# Altium project Rover Power Board V1.PrjPcb
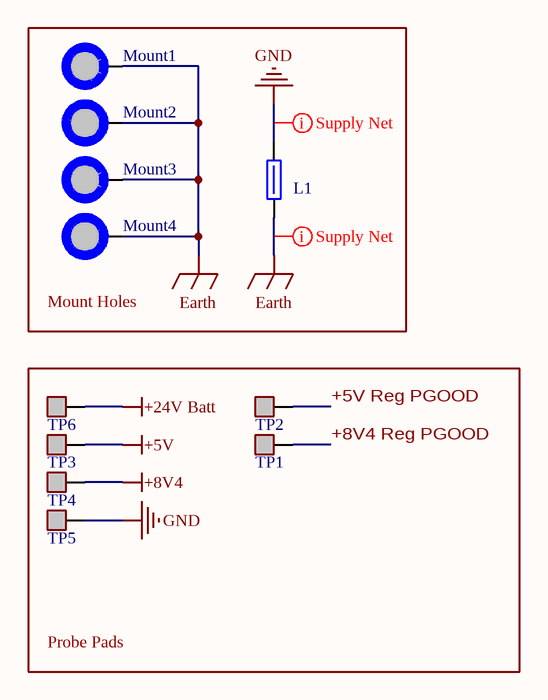
[diagram p0: Overview.SchDoc]
4 sheets, 56 parts. Net scope: global (net labels, ports and power ports of the same name join across sheets).
Board file: Main.PcbDoc
Sheets:
  Overview.SchDoc
  Voltage Regulators.SchDoc
  Power Inputs.SchDoc
  Power Outputs.SchDoc

## Sheet Overview.SchDoc
size A; SheetNumber: 1; SheetTotal: 4

### Parts
L1  652-MH2029-300Y  [[Ferrite] SMD Bead 0805 (1)]  (value not drawn)
Mount1  M3 Mount Hole  [[Mount] M3 Mount Hole]  (value not drawn)  (no BOM)
Mount2  M3 Mount Hole  [[Mount] M3 Mount Hole]  (value not drawn)  (no BOM)
Mount3  M3 Mount Hole  [[Mount] M3 Mount Hole]  (value not drawn)  (no BOM)
Mount4  M3 Mount Hole  [[Mount] M3 Mount Hole]  (value not drawn)  (no BOM)
TP1  Probe Pad  [[Probe] Touch Pad]  (value not drawn)  (no BOM)
TP2  Probe Pad  [[Probe] Touch Pad]  (value not drawn)  (no BOM)
TP3  Probe Pad  [[Probe] Touch Pad]  (value not drawn)  (no BOM)
TP4  Probe Pad  [[Probe] Touch Pad]  (value not drawn)  (no BOM)
TP5  Probe Pad  [[Probe] Touch Pad]  (value not drawn)  (no BOM)
TP6  Probe Pad  [[Probe] Touch Pad]  (value not drawn)  (no BOM)

### Blocks framed on the sheet
Mount Holes: L1 Mount1-Mount4
Probe Pads: TP1-TP6

### Nets
+5V: TP3.1
+8V4: TP4.1
+24V Batt: TP6.1
Earth: L1.1 Mount1.1 Mount2.1 Mount3.1 Mount4.1
GND: L1.2 TP5.1
+5V Reg PGOOD: TP2.1
+8V4 Reg PGOOD: TP1.1

### Layout directives
net class Supply_Nets: Earth, GND

### Library data of the parts
L1 = [Ferrite] SMD Ferrite Bead (1): Res @ Freq: 30 @ 100MHz; Size Package: 0805; Supplier 1: DigiKey; Supplier Part Number 1: MH2029-300YCT-ND
Mount1-Mount4 = [Mount] M3 Mount Hole: Place at least 4.5mm from board edge. Plated.
TP1-TP6 = [Probe] Touch Pad

## Sheet Voltage Regulators.SchDoc
size B; SheetNumber: 2; SheetTotal: 4
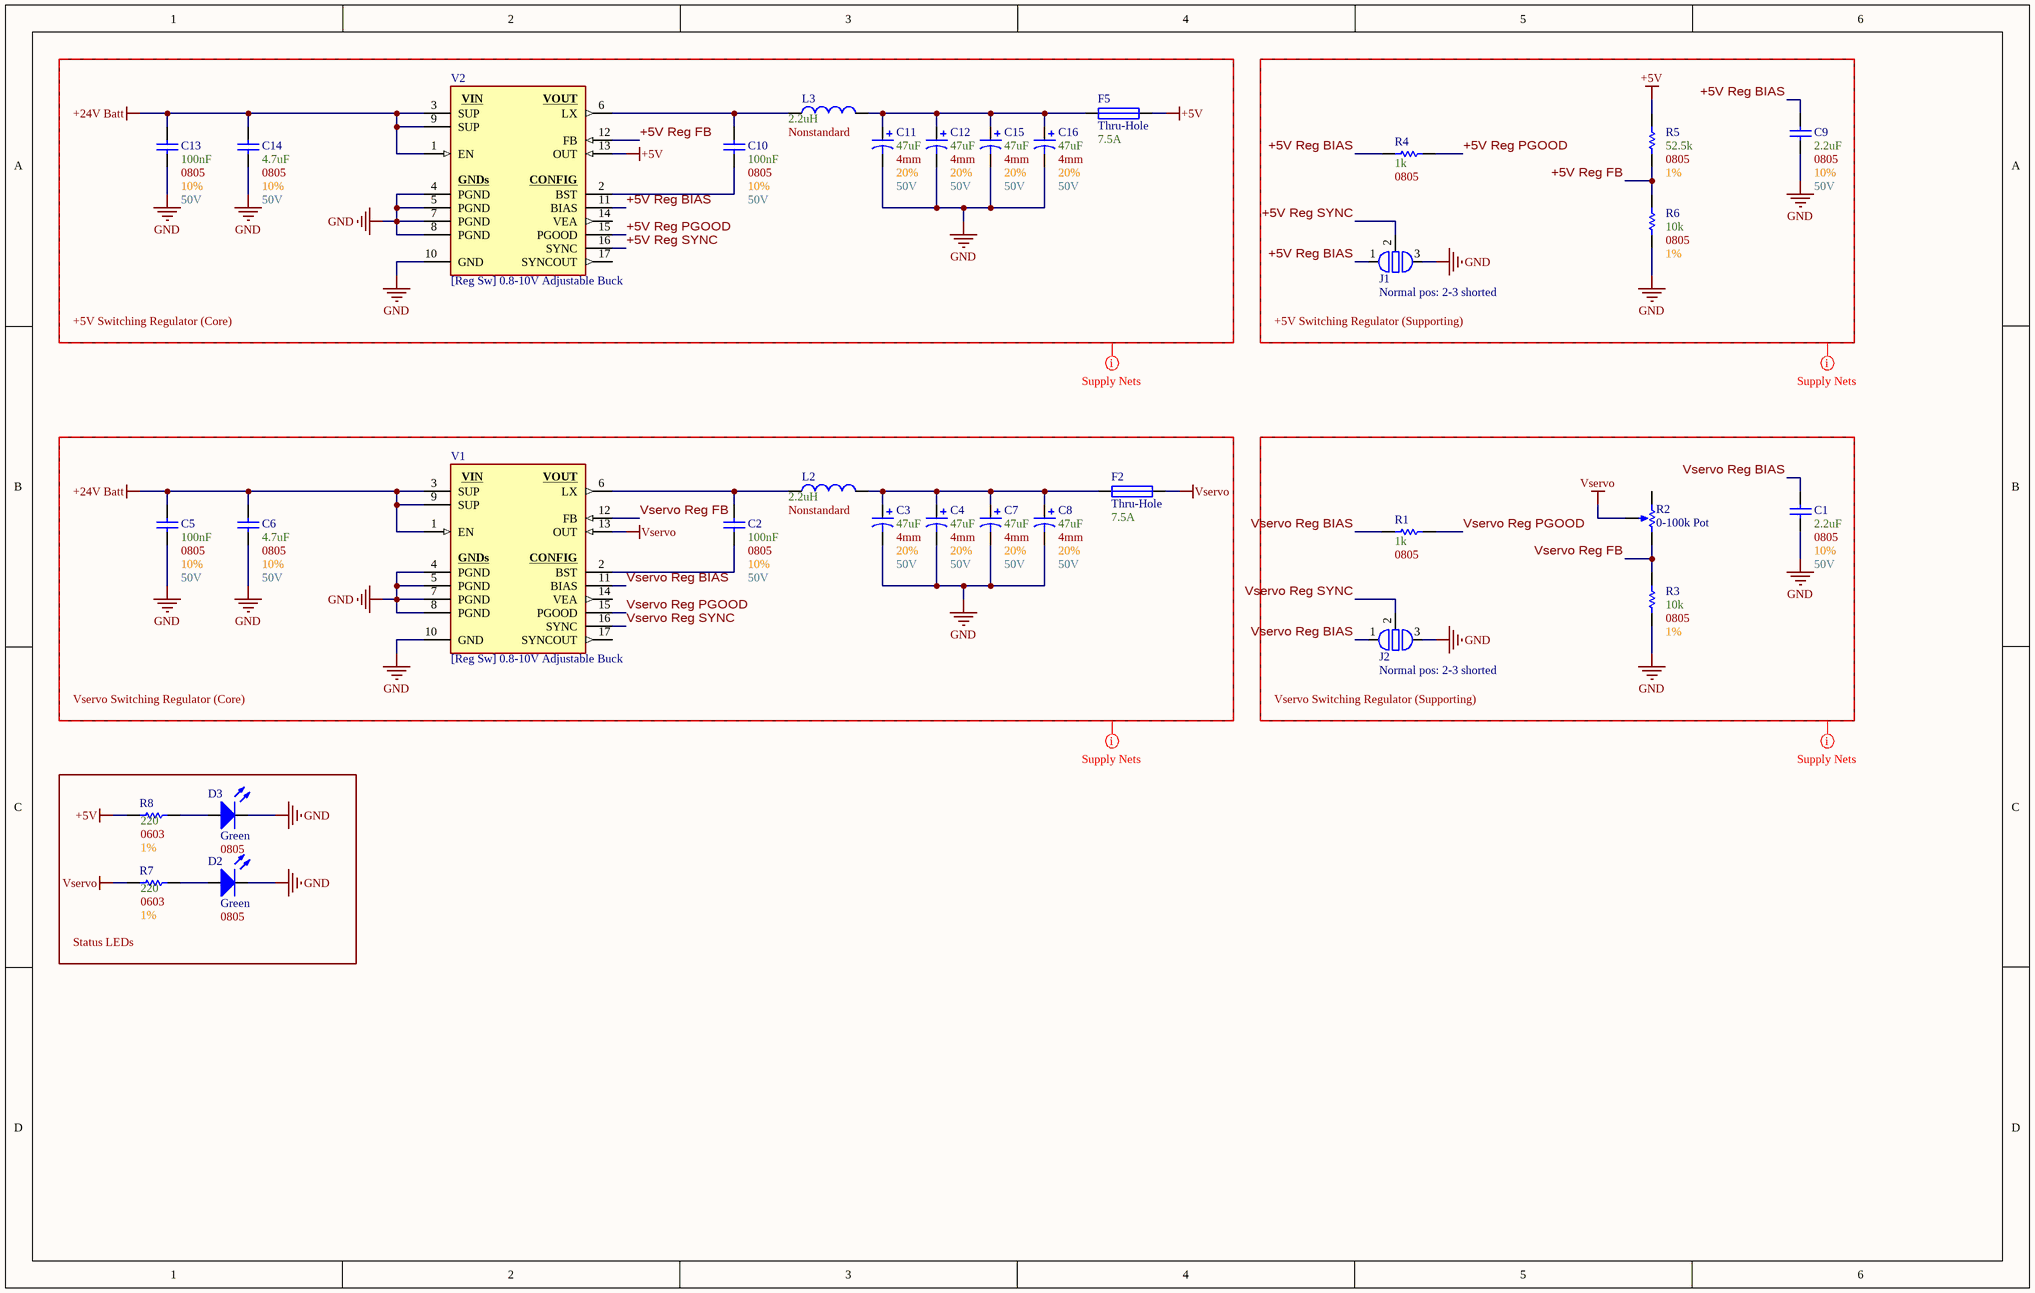
[diagram p1: Voltage Regulators.SchDoc]

### Parts
C1  Voltage: 50V  Tolerance: 10%  Size Package: 0805  Capacitance: 2.2uF  [[Cap] SMD 0805]  (hidden comment: SMD Nonpolarized)
C2  Voltage: 50V  Tolerance: 10%  Size Package: 0805  Capacitance: 100nF  [[Cap] SMD 0805]  (hidden comment: SMD Nonpolarized)
C3  Tolerance: 20%  Max Voltage: 50V  Capacitance: 47uF  Diameter: 4mm  [[Cap] SMD Polarized, 4mm]  (hidden comment: SMD Polarized)
C4  Tolerance: 20%  Max Voltage: 50V  Capacitance: 47uF  Diameter: 4mm  [[Cap] SMD Polarized, 4mm]  (hidden comment: SMD Polarized)
C5  Voltage: 50V  Tolerance: 10%  Size Package: 0805  Capacitance: 100nF  [[Cap] SMD 0805]  (hidden comment: SMD Nonpolarized)
C6  Voltage: 50V  Tolerance: 10%  Size Package: 0805  Capacitance: 4.7uF  [[Cap] SMD 0805]  (hidden comment: SMD Nonpolarized)
C7  Tolerance: 20%  Max Voltage: 50V  Capacitance: 47uF  Diameter: 4mm  [[Cap] SMD Polarized, 4mm]  (hidden comment: SMD Polarized)
C8  Tolerance: 20%  Max Voltage: 50V  Capacitance: 47uF  Diameter: 4mm  [[Cap] SMD Polarized, 4mm]  (hidden comment: SMD Polarized)
C9  Voltage: 50V  Tolerance: 10%  Size Package: 0805  Capacitance: 2.2uF  [[Cap] SMD 0805]  (hidden comment: SMD Nonpolarized)
C10  Voltage: 50V  Tolerance: 10%  Size Package: 0805  Capacitance: 100nF  [[Cap] SMD 0805]  (hidden comment: SMD Nonpolarized)
C11  Tolerance: 20%  Max Voltage: 50V  Capacitance: 47uF  Diameter: 4mm  [[Cap] SMD Polarized, 4mm]  (hidden comment: SMD Polarized)
C12  Tolerance: 20%  Max Voltage: 50V  Capacitance: 47uF  Diameter: 4mm  [[Cap] SMD Polarized, 4mm]  (hidden comment: SMD Polarized)
C13  Voltage: 50V  Tolerance: 10%  Size Package: 0805  Capacitance: 100nF  [[Cap] SMD 0805]  (hidden comment: SMD Nonpolarized)
C14  Voltage: 50V  Tolerance: 10%  Size Package: 0805  Capacitance: 4.7uF  [[Cap] SMD 0805]  (hidden comment: SMD Nonpolarized)
C15  Tolerance: 20%  Max Voltage: 50V  Capacitance: 47uF  Diameter: 4mm  [[Cap] SMD Polarized, 4mm]  (hidden comment: SMD Polarized)
C16  Tolerance: 20%  Max Voltage: 50V  Capacitance: 47uF  Diameter: 4mm  [[Cap] SMD Polarized, 4mm]  (hidden comment: SMD Polarized)
D2  Color: Green  Size Package: 0805  [[LED] SMD 0805]  (hidden comment: SMD LED)
D3  Color: Green  Size Package: 0805  [[LED] SMD 0805]  (hidden comment: SMD LED)
F2  Thru-Hole  Capacity: 7.5A  [[Fuse] Thru-Hole Blade]
F5  Thru-Hole  Capacity: 7.5A  [[Fuse] Thru-Hole Blade]
J1  Normal pos: 2-3 shorted  [[Jumper] Thru-Hole 3pin]
J2  Normal pos: 2-3 shorted  [[Jumper] Thru-Hole 3pin]
L2  Size Package: Nonstandard  Inductance: 2.2uH  [[Inductor] 7.4 X 6.6 X 3 MM]  (hidden comment: SMD Inductor)
L3  Size Package: Nonstandard  Inductance: 2.2uH  [[Inductor] 7.4 X 6.6 X 3 MM]  (hidden comment: SMD Inductor)
R1  Resistance: 1k  Size Package: 0805  [[Res] SMD 0805]  (hidden comment: [Res] SMD Resistor)
R2  0-100k Pot  [[Res] Pot 100k 0.5W]
R3  Tolerance: 1%  Resistance: 10k  Size Package: 0805  [[Res] SMD 0805]  (hidden comment: [Res] SMD Resistor)
R4  Resistance: 1k  Size Package: 0805  [[Res] SMD 0805]  (hidden comment: [Res] SMD Resistor)
R5  Tolerance: 1%  Resistance: 52.5k  Size Package: 0805  [[Res] SMD 0805]  (hidden comment: [Res] SMD Resistor)
R6  Tolerance: 1%  Resistance: 10k  Size Package: 0805  [[Res] SMD 0805]  (hidden comment: [Res] SMD Resistor)
R7  Resistance: 220  Size Package: 0603  Tolerance: 1%  [[Res] SMD 0603]  (hidden comment: [Res] SMD Resistor)
R8  Resistance: 220  Size Package: 0603  Tolerance: 1%  [[Res] SMD 0603]  (hidden comment: [Res] SMD Resistor)
V1  [Reg Sw] 0.8-10V Adjustable Buck  [[Reg] 0.8-10V Adjustable Buck]
V2  [Reg Sw] 0.8-10V Adjustable Buck  [[Reg] 0.8-10V Adjustable Buck]

### Blocks framed on the sheet
+5V Switching Regulator (Core): C10-C16 F5 L3 V2
+5V Switching Regulator (Supporting): C9 J1 R4-R6
Vservo Switching Regulator (Core): C2-C8 F2 L2 V1
Vservo Switching Regulator (Supporting): C1 J2 R1-R3
Status LEDs: D2 D3 R7 R8

### Nets
+5V: F5.2 R5.2 R8.2 V2.13(OUT)
+24V Batt: C5.2 C6.2 C13.2 C14.2 V1.1(EN) V1.3(SUP) V1.9(SUP) V2.1(EN) V2.3(SUP) V2.9(SUP)
GND: C1.1 C3.2 C4.2 C5.1 C6.1 C7.2 C8.2 C9.1 C11.2 C12.2 C13.1 C14.1 C15.2 C16.2 D2.2(Cathode) D3.2(Cathode) J1.3 J2.3 R3.1 R6.1 V1.4(PGND) V1.5(PGND) V1.7(PGND) V1.8(PGND) V1.10(GND) V2.4(PGND) V2.5(PGND) V2.7(PGND) V2.8(PGND) V2.10(GND)
Vservo: F2.2 R2.2(TAP) R7.2 V1.13(OUT)
+5V Reg BIAS: C9.2 J1.1 R4.1 V2.11(BIAS)
+5V Reg FB: R5.1 R6.2 V2.12(FB)
+5V Reg PGOOD: R4.2 V2.15(PGOOD)
+5V Reg SYNC: J1.2(Common) V2.16(SYNC)
Vservo Reg BIAS: C1.2 J2.1 R1.1 V1.11(BIAS)
Vservo Reg FB: R2.3(BOT) R3.2 V1.12(FB)
Vservo Reg PGOOD: R1.2 V1.15(PGOOD)
Vservo Reg SYNC: J2.2(Common) V1.16(SYNC)
NetC2_1: C2.1 V1.2(BST)
NetC2_2: C2.2 L2.1 V1.6(LX)
NetC3_1: C3.1 C4.1 C7.1 C8.1 F2.1 L2.2
NetC10_1: C10.1 V2.2(BST)
NetC10_2: C10.2 L3.1 V2.6(LX)
NetC11_1: C11.1 C12.1 C15.1 C16.1 F5.1 L3.2
NetD2_1: D2.1(Anode) R7.1
NetD3_1: D3.1(Anode) R8.1

Not connected (* = marked no-connect by the designer): R2 1(TOP); V1 14(VEA) 17(SYNCOUT); V2 14(VEA) 17(SYNCOUT)

### Layout directives
net class Supply_Nets: +5V, +5V Reg BIAS, +5V Reg FB, +5V Reg PGOOD, +5V Reg SYNC, +24V Batt, GND, Vservo, Vservo Reg BIAS, Vservo Reg FB, Vservo Reg PGOOD, Vservo Reg SYNC

### Notes on the sheet
- (in symbol [Reg Sw] 0.8-10V Adjustable Buck) VIN; VOUT; GNDs; CONFIG
- (in symbol [Reg] 0.8-10V Adjustable Buck) VIN; VOUT; GNDs; CONFIG

### Library data of the parts
C1 C2 C5 C6 C9 C10 C13 C14 = [Cap] SMD Nonpolarized: Supplier 1: DigiKey
  C1 C9: Supplier Part Number 1: 587-3169-1-ND
  C2 C5 C10 C13: Supplier Part Number 1: 1276-1003-6-ND
  C6 C14: Supplier Part Number 1: 490-12394-1-ND
C3 C4 C7 C8 C11 C12 C15 C16 = [Cap] SMD Polarized: Supplier 1: DigiKey; Supplier Part Number 1: 10-EEE-FN1A470URCT-ND
D2 D3 = [LED] SMD: Generic; Part #: *; Supplier 1: DigiKey; Supplier Part Number 1: 475-LGR971-KN-1CT-ND
F2 F5 = [Fuse] Thru-Hole Blade: Mouser Part #: *; Supplier 1: DigiKey; Supplier Part Number 1: WK6265-ND
J1 J2 = [Jump] Thru-Hole 3pin: Clip Jumper; NO/NC: 2,3 NC
L2 L3 = [Inductor] SMD Inductor: JLC Part #: *; Mouser Part #: *; Supplier 1: DigiKey; Supplier Part Number 1: XC2402CT-ND
R1 R3-R8 = [Res] SMD Resistor: Generic; Supplier 1: DigiKey
  R1 R4: Supplier Part Number 1: RR12P1.0KDCT-ND
  R3 R6: Supplier Part Number 1: 311-10KARCT-ND
  R5: Supplier Part Number 1: 311-52.3KCRCT-ND
  R7 R8: Supplier Part Number 1: 311-220HRCT-ND
R2 = [Res] Pot 100k 0.5W: Supplier 1: DigiKey; Supplier Part Number 1: 3386P-104LF-ND
V1 V2 = [Reg Sw] 0.8-10V Adjustable Buck: MAX20408AFOF/VY+; Supplier 1: DigiKey; Supplier Part Number 1: 505-MAX20408AFOF/VY+-ND

## Sheet Power Inputs.SchDoc
size A; SheetNumber: 3; SheetTotal: 4
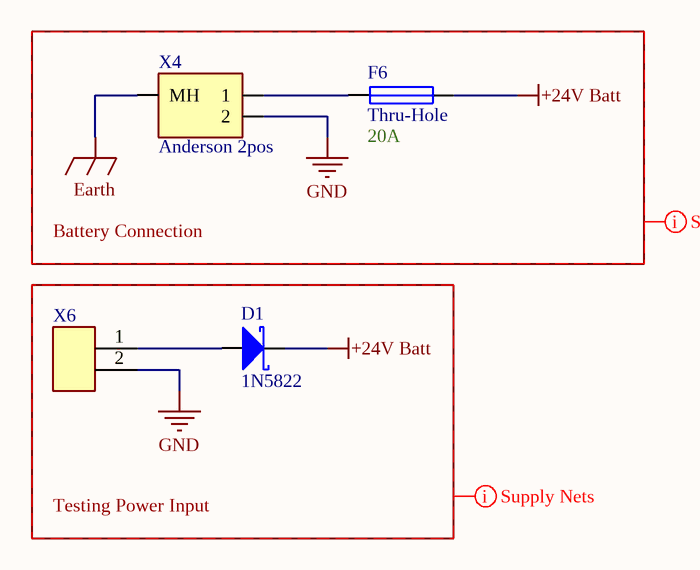
[diagram p2: Power Inputs.SchDoc]

### Parts
D1  1N5822  [[Diode] Thru-Hole Schottky]
F6  Thru-Hole  Capacity: 20A  [[Fuse] Thru-Hole Blade]
X4  Anderson 2pos  [[Anderson] 2pos Right-Angle 1327G17]
X6  2pin Screw Terminal  [[Screw Terminal] 2pin 5mm]  (value not drawn)

### Blocks framed on the sheet
Battery Connection: F6 X4
Testing Power Input: D1 X6

### Nets
+24V Batt: D1.1(K) F6.2
Earth: X4.MH
GND: X4.2 X6.2
NetD1_2: D1.2(A) X6.1
NetF6_1: F6.1 X4.1

### Layout directives
net class Supply_Nets: +24V Batt, Earth, GND

### Library data of the parts
D1 = [Diode] Thru-Hole Schottky: Mouser Part #: 511-1N5822; Supplier 1: DigiKey; Supplier Part Number 1: 1N5822GOS-ND
F6 = [Fuse] Thru-Hole Blade: Mouser Part #: *; Supplier 1: DigiKey; Supplier Part Number 1: WK6265-ND
X4 = [Anderson] 2pos Right-Angle 1327G17
X6 = [Screw Terminal] 2pin: Supplier 1: DigiKey; Supplier Part Number 1: 102-6145-ND

## Sheet Power Outputs.SchDoc
size A; SheetNumber: 4; SheetTotal: 4
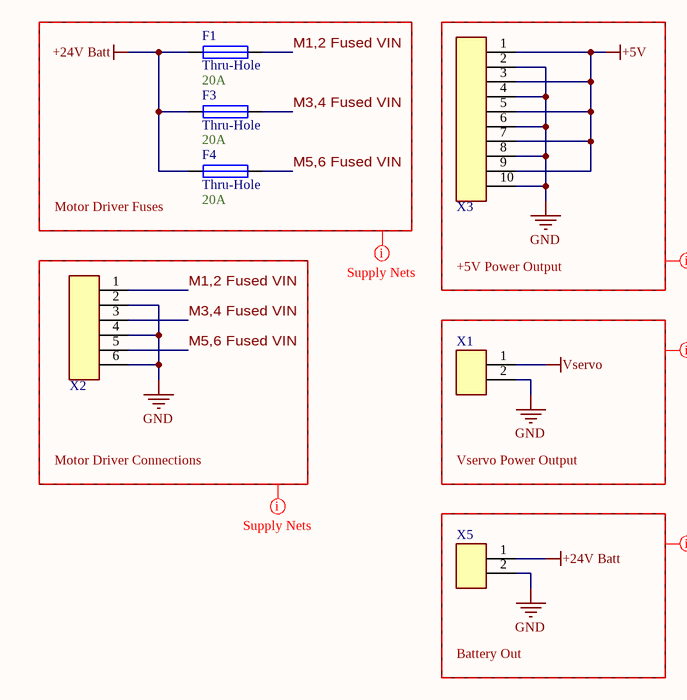
[diagram p3: Power Outputs.SchDoc]

### Parts
F1  Thru-Hole  Capacity: 20A  [[Fuse] Thru-Hole Blade]
F3  Thru-Hole  Capacity: 20A  [[Fuse] Thru-Hole Blade]
F4  Thru-Hole  Capacity: 20A  [[Fuse] Thru-Hole Blade]
X1  2pin Screw Terminal  [[Screw Terminal] 2pin 5mm]  (value not drawn)
X2  [Screw Terminal] 6pin  [[Screw Terminal] 6pin]  (value not drawn)
X3  [Screw Terminal] 10pin  [[Screw Terminal] 10pin]  (value not drawn)
X5  2pin Screw Terminal  [[Screw Terminal] 2pin 5mm]  (value not drawn)

### Blocks framed on the sheet
Motor Driver Fuses: F1 F3 F4
+5V Power Output: X3
Motor Driver Connections: X2
Vservo Power Output: X1
Battery Out: X5

### Nets
+5V: X3.1 X3.3 X3.5 X3.7 X3.9
+24V Batt: F1.1 F3.1 F4.1 X5.1
GND: X1.2 X2.2 X2.4 X2.6 X3.2 X3.4 X3.6 X3.8 X3.10 X5.2
Vservo: X1.1
M1,2 Fused VIN: F1.2 X2.1
M3,4 Fused VIN: F3.2 X2.3
M5,6 Fused VIN: F4.2 X2.5

### Layout directives
net class Supply_Nets: +5V, +24V Batt, GND, M1,2 Fused VIN, M3,4 Fused VIN, M5,6 Fused VIN, Vservo

### Library data of the parts
F1 F3 F4 = [Fuse] Thru-Hole Blade: Mouser Part #: *; Supplier 1: DigiKey; Supplier Part Number 1: WK6265-ND
X1 X5 = [Screw Terminal] 2pin: Supplier 1: DigiKey; Supplier Part Number 1: 102-6145-ND
X2 = [Screw Terminal] 6pin: x3; Supplier 1: DigiKey; Supplier Part Number 1: 102-6145-ND
X3 = [Screw Terminal] 10pin: x5; Supplier 1: DigiKey; Supplier Part Number 1: 102-6145-ND

## Nets that join several sheets
+5V: Overview (TP3.1), Voltage Regulators (F5.2 R5.2 R8.2 V2.13), Power Outputs (5 pins)
+24V Batt: Overview (TP6.1), Voltage Regulators (10 pins), Power Inputs (D1.1 F6.2), Power Outputs (F1.1 F3.1 F4.1 X5.1)
Earth: Overview (5 pins), Power Inputs (X4.MH)
GND: Overview (L1.2 TP5.1), Voltage Regulators (30 pins), Power Inputs (X4.2 X6.2), Power Outputs (10 pins)
Vservo: Voltage Regulators (F2.2 R2.2 R7.2 V1.13), Power Outputs (X1.1)
+5V Reg PGOOD: Overview (TP2.1), Voltage Regulators (R4.2 V2.15)